# EAGLE design ATTiny85_LightBar (EAGLE 9.6.2)
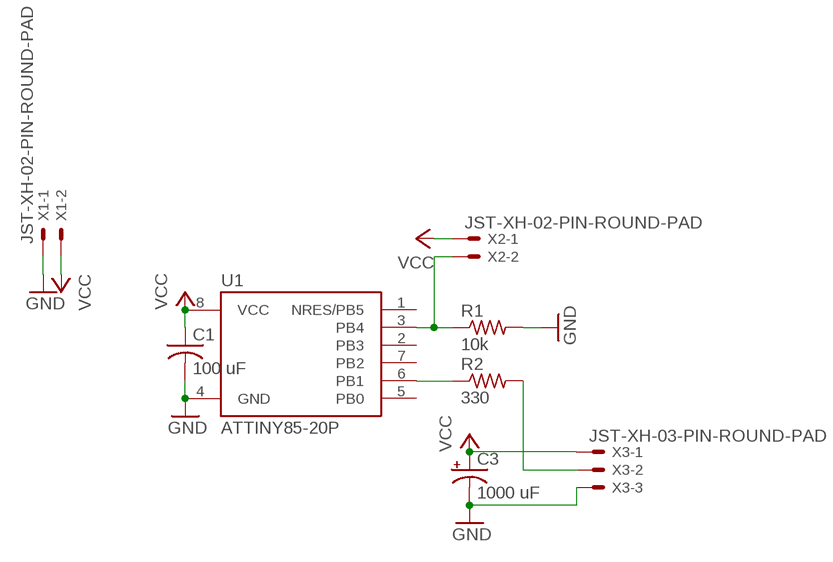
[diagram p0: schematic, sheet 1]

## Parts
C1  100 uF  C-USC0805  [C0805]
C3  1000 uF  CPOL-USE5-10.5  [E5-10,5]
R1  10k  R-US_R0805  [R0805]
R2  330  R-US_R0805  [R0805]
U1  ATTINY85-20P  [PDIP08_300MIL]
X1  JST-XH-02-PIN-ROUND-PAD  [JST-XH-02-PACKAGE-ROUND-PAD]
X2  JST-XH-02-PIN-ROUND-PAD  [JST-XH-02-PACKAGE-ROUND-PAD]
X3  JST-XH-03-PIN-ROUND-PAD  [JST-XH-03-PACKAGE-ROUND-PAD]

## Nets
GND: C1.2 C3.- R1.2 U1.4(GND) X1.1 X3.3
N$2: R1.1 U1.3(PB4) X2.2
N$4: R2.1 U1.6(PB1)
N$5: R2.2 X3.2
VCC: C1.1 C3.+ U1.8(VCC) X1.2 X2.1 X3.1
Unconnected: U1.1(NRES/PB5) U1.2(PB3) U1.5(PB0) U1.7(PB2)

## Library data of the parts
C1 = adafruit:C-US: CAPACITOR, American symbol
C3 = adafruit:CPOL-US: POLARIZED CAPACITOR, American symbol
R1 R2 = adafruit:R-US_: RESISTOR, American symbol
U1 = _hhn_attiny25_45_85:ATTINY85*: ATMEL ATtiny 85 Packages: P = PDIP 08 30mil S = SOIC 08 EIAJ 208mil Technologies Note: for complete ordering code (temp. range, finish, tape&reel etc.) see www.atmel.com • Supply Voltage: V = (1.8…5.5)V | [blank] = (2.7…5.5)V • Speed: 10 = 10 MHz | 20 = 20 MHz Author: Dipl.-Ing. FH Rainer Bayer HHN Hochschule Heilbronn (Heilbronn University), rainer.bayer@hs-heilbronn.de Ingenieurbüro ing-rb, mail@ing-rb.de
X1 X2 = Rembrandt Electronics - JST XH Connectors v1-0:JST-XH-02-PIN: JST XH Connector 2 Pin Wire to board connector. Pitch: 2,54 mm, (0.100") Number of pins: 2 Created by Rembrandt Electronics www.rembrandtelectronics.com
X3 = Rembrandt Electronics - JST XH Connectors v1-0:JST-XH-03-PIN: JST XH Connector 2 Pin Wire to board connector. Pitch: 2,54 mm, (0.100") Number of pins: 3 Created by Rembrandt Electronics www.rembrandtelectronics.com

## Board
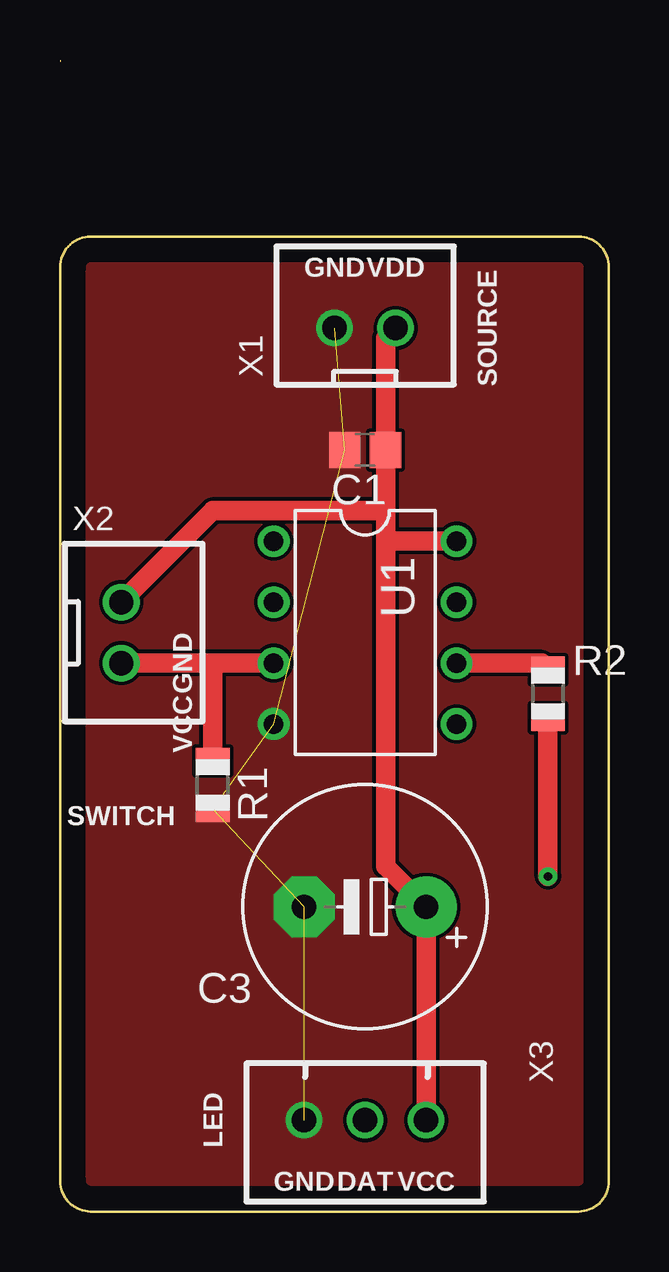
[diagram p1: board, top side]
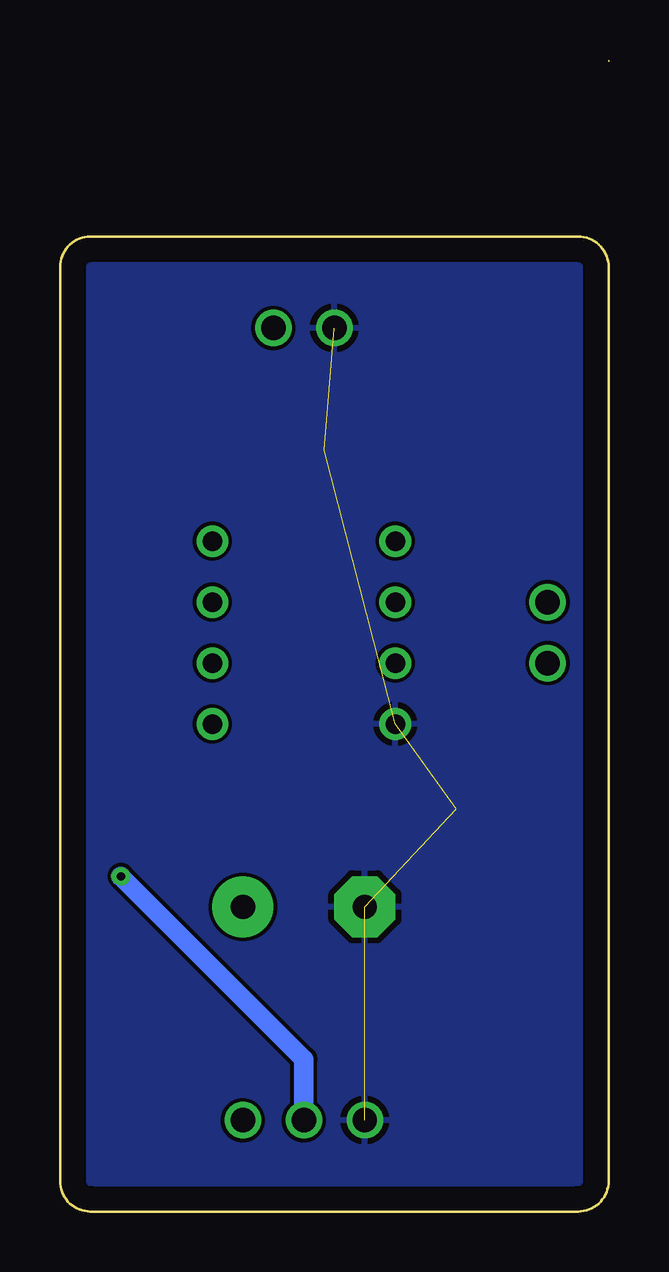
[diagram p2: board, bottom side, seen from below]

Size 22.87 x 48 mm. Coordinates in mm from the lower left corner, seen from the top.
Outline: 0.02,48 arc90 0.01,47.92
Outline: 1.28,40.64 21.6,40.64 arc-90 22.87,39.37 22.87,1.27 arc-90 21.6,0 1.28,0 arc-90 0.01,1.27 0.01,39.37 arc-90 1.28,40.64
Copper layers (1*16): Top 0.035mm / dielectric 1.5mm / Bottom 0.035mm
Design rules "default": minimum track width 6mil, minimum drill 0.35mm, track to track 6mil, track to pad 6mil, pad to pad 6mil, via to via 6mil, smd to smd 6mil, copper to edge 40mil, drill to drill 6mil, minimum pad ring 10mil, minimum via ring 8mil, stop-mask expansion 4mil, vias tented up to drill 0mil, thermal gap 10mil

### Footprints (pad centres in the part's own frame; a part is rotated, then mirrored left to right if it is on the bottom)
C0805 = smd 1.3 x 1.5: 1 -0.85,0; 2 0.85,0
E5-10,5 = drill 1.016 pad 2.54: + -2.54,0 | drill 1.016 pad 2.54 octagon: - 2.54,0
R0805 = smd 1.1 x 1.4: 1 -1,0; 2 1,0
PDIP08_300MIL = drill 0.813: 1 -3.81,-3.81; 2 -1.27,-3.81; 3 1.27,-3.81; 4 3.81,-3.81; 5 3.81,3.81; 6 1.27,3.81; 7 -1.27,3.81; 8 -3.81,3.81
JST-XH-02-PACKAGE-ROUND-PAD = drill 1.016: 1 -1.27,0; 2 1.27,0
JST-XH-03-PACKAGE-ROUND-PAD = drill 1.016: 1 -2.54,0; 2 0,0; 3 2.54,0

### Placement (x,y rotation side)
C1  12.71,31.75 180 top
C3  12.71,12.7 180 top
R1  6.36,17.78 270 top
R2  20.33,21.59 270 top
U1  12.71,24.13 270 top
X1  12.71,36.83 0 top
X2  2.55,24.13 270 top
X3  12.71,3.81 180 top

### Tracks (layer width: path | path; a pad name or v marks a point on that pad's centre or on a via)
GND  (5 unrouted)
  pour Top (no thermals): 0.01,0 0.01,40.64 22.87,40.64 22.87,0
  pour Bottom: 0.01,40.64 22.87,40.64 22.87,0 0.01,0
N$2
  Top 0.813: U1.3 6.36,22.86 | 6.36,22.86 X2.2 | R1.1 6.36,22.86
N$4
  Top 0.813: R2.1 20.06,22.86 U1.6
N$5  (via drill 0.35)
  Top 0.813: v20.33,13.97 R2.2
  Bottom 0.813: X3.2 12.71,6.35 v20.33,13.97
VCC
  Top 0.813: 13.56,27.94 13.56,29.21 6.36,29.21 X2.1 | 13.56,27.94 13.56,25.4 13.56,14.39 C3.+ X3.1 | 13.56,27.94 C1.1 13.56,36.41 X1.2 | U1.8 13.56,27.94

### Text on the board
tPlace: GND | VDD | SOURCE | GND | VCC | SWITCH | LED | GND | DAT | VCC